# Altium project UI_Board.PrjPcb
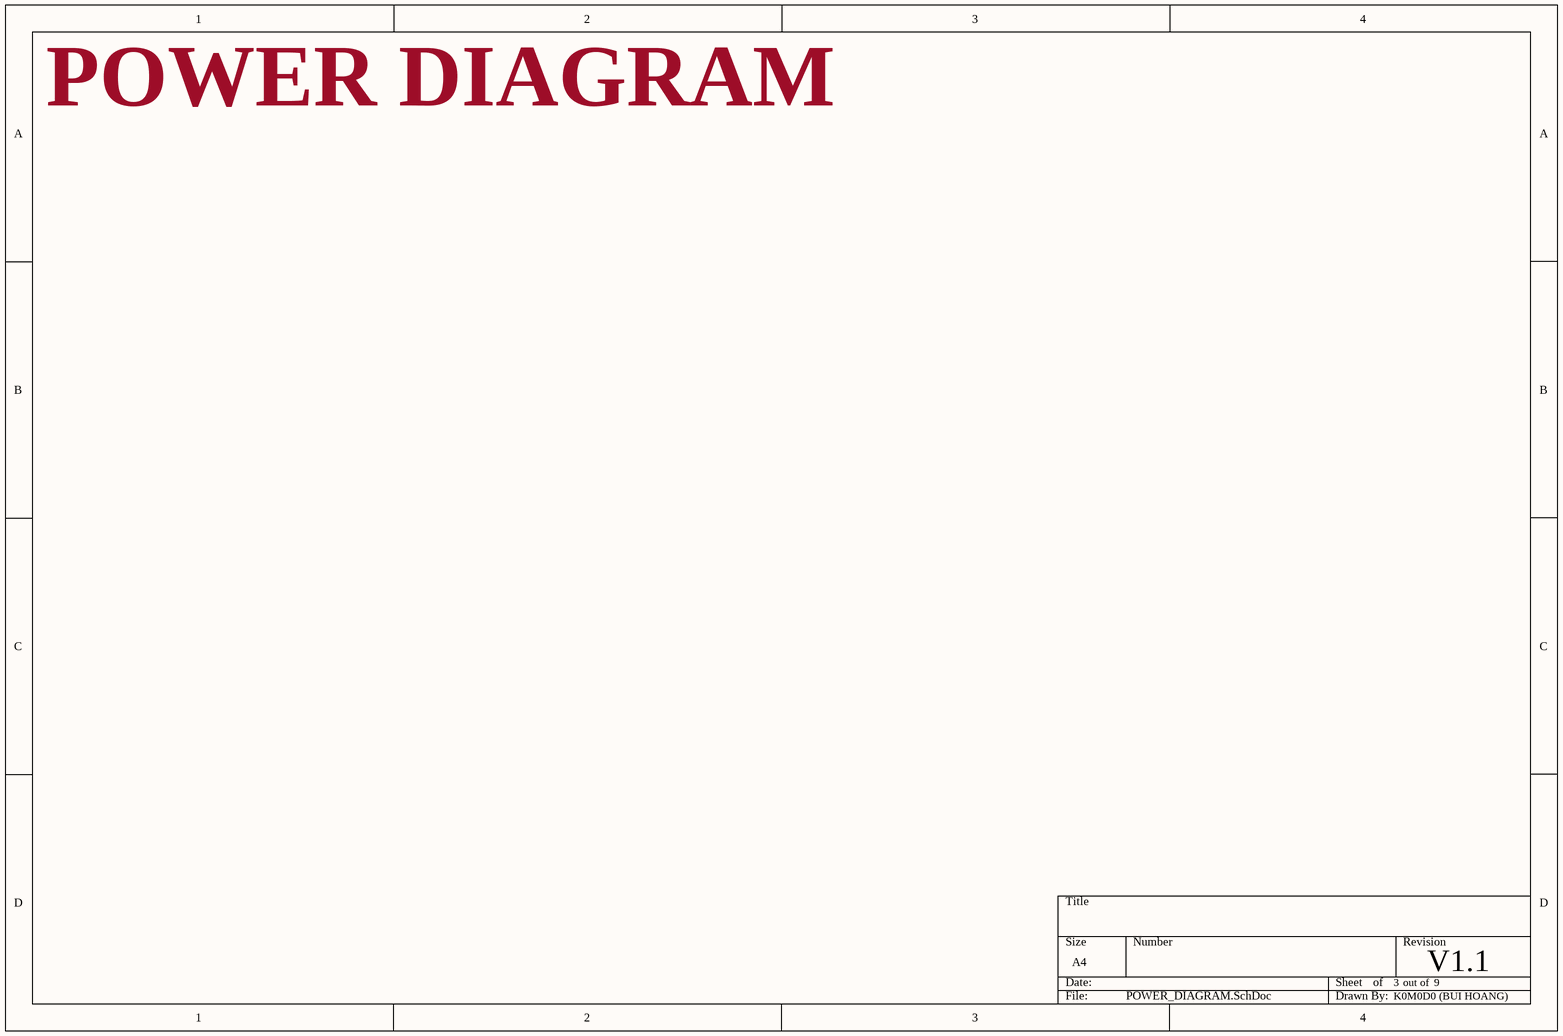
[diagram p0: POWER_DIAGRAM.SchDoc]
Author: K0M0D0 (BUI HOANG); Revision: V1.1; Title: UI BOARD
6 sheets, 197 parts. Net scope: flat (ports and power ports of the same name join across sheets).
Board file: UI_PCB.PcbDoc
Sheets:
  POWER_DIAGRAM.SchDoc
  LCD_PWR.SchDoc
  UI_MAIN.SchDoc
  F1C100s.SchDoc
  LCD.SchDoc
  CONNS.SchDoc

## Sheet POWER_DIAGRAM.SchDoc: UI BOARD
size A4; SheetNumber: 3; SheetTotal: 9

### Notes on the sheet
- POWER DIAGRAM
- out of

## Sheet LCD_PWR.SchDoc: UI BOARD
size A4; SheetNumber: 5; SheetTotal: 9
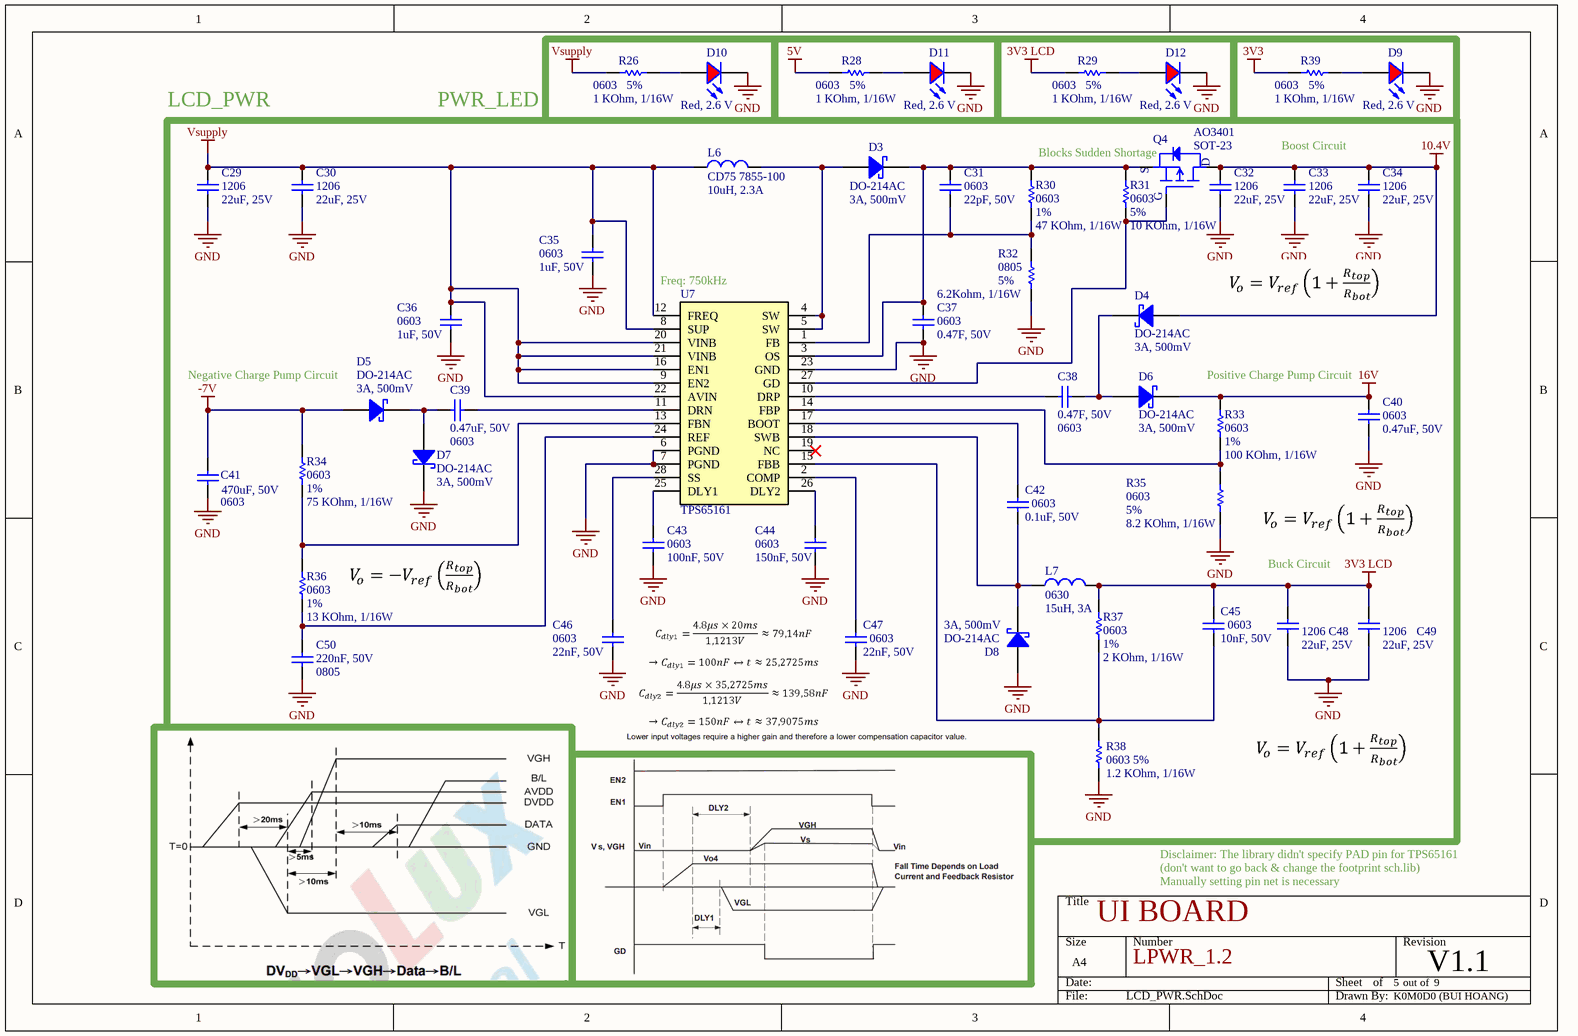
[diagram p1: LCD_PWR.SchDoc]

### Parts
C29  Package: 1206  [C_1206]  (hidden comment: 22uF, 25V)
C30  Package: 1206  [C_1206]  (hidden comment: 22uF, 25V)
C31  Package: 0603  [C_0603]  (hidden comment: 22pF, 50V)
C32  Package: 1206  [C_1206]  (hidden comment: 22uF, 25V)
C33  Package: 1206  [C_1206]  (hidden comment: 22uF, 25V)
C34  Package: 1206  [C_1206]  (hidden comment: 22uF, 25V)
C35  Package: 0603  [C_0603]  (hidden comment: 1uF, 50V)
C36  Package: 0603  [C_0603]  (hidden comment: 1uF, 50V)
C37  Package: 0603  [C_0603]  (hidden comment: 0.47F, 50V)
C38  Package: 0603  [C_0603]  (hidden comment: 0.47F, 50V)
C39  Package: 0603  [C_0603]  (hidden comment: 0.47uF, 50V)
C40  Package: 0603  [C_0603]  (hidden comment: 0.47uF, 50V)
C41  Package: 0603  [C_0603]  (hidden comment: 470uF, 50V)
C42  Package: 0603  [C_0603]  (hidden comment: 0.1uF, 50V)
C43  Package: 0603  [C_0603]  (hidden comment: 100nF, 50V)
C44  Package: 0603  [C_0603]  (hidden comment: 150nF, 50V)
C45  Package: 0603  [C_0603]  (hidden comment: 10nF, 50V)
C46  Package: 0603  [C_0603]  (hidden comment: 22nF, 50V)
C47  Package: 0603  [C_0603]  (hidden comment: 22nF, 50V)
C48  Package: 1206  [C_1206]  (hidden comment: 22uF, 25V)
C49  Package: 1206  [C_1206]  (hidden comment: 22uF, 25V)
C50  Package: 0805  [C_0805]  (hidden comment: 220nF, 50V)
D3  Package: DO-214AC  [PKG_SMA (DO-214AC)]  (hidden comment: 3A, 500mV)
D4  Package: DO-214AC  [PKG_SMA (DO-214AC)]  (hidden comment: 3A, 500mV)
D5  Package: DO-214AC  [PKG_SMA (DO-214AC)]  (hidden comment: 3A, 500mV)
D6  Package: DO-214AC  [PKG_SMA (DO-214AC)]  (hidden comment: 3A, 500mV)
D7  Package: DO-214AC  [PKG_SMA (DO-214AC)]  (hidden comment: 3A, 500mV)
D8  Package: DO-214AC  [PKG_SMA (DO-214AC)]  (hidden comment: 3A, 500mV)
D9  Red, 2.6 V  [LED_1206]
D10  Red, 2.6 V  [LED_1206]
D11  Red, 2.6 V  [LED_1206]
D12  Red, 2.6 V  [LED_1206]
L6  Package: CD75 7855-100  [COIL_CDRH]  (hidden comment: 10uH, 2.3A)
L7  Package: 0630  [COIL_74]  (hidden comment: 15uH, 3A)
Q4  AO3401  Package: SOT-23  [PKG_SOT-23]
R26  Package: 0603  Acc: 5%  [R_0603]  (hidden comment: 1 KOhm, 1/16W)
R28  Package: 0603  Acc: 5%  [R_0603]  (hidden comment: 1 KOhm, 1/16W)
R29  Package: 0603  Acc: 5%  [R_0603]  (hidden comment: 1 KOhm, 1/16W)
R30  Package: 0603  Acc: 1%  [R_0603]  (hidden comment: 47 KOhm, 1/16W)
R31  Package: 0603  Acc: 5%  [R_0603]  (hidden comment: 10 KOhm, 1/16W)
R32  Package: 0805  Acc: 5%  [R_0805]  (hidden comment: 6.2Kohm, 1/16W)
R33  Package: 0603  Acc: 1%  [R_0603]  (hidden comment: 100 KOhm, 1/16W)
R34  Package: 0603  Acc: 1%  [R_0603]  (hidden comment: 75 KOhm, 1/16W)
R35  Package: 0603  Acc: 5%  [R_0603]  (hidden comment: 8.2 KOhm, 1/16W)
R36  Package: 0603  Acc: 1%  [R_0603]  (hidden comment: 13 KOhm, 1/16W)
R37  Package: 0603  Acc: 1%  [R_0603]  (hidden comment: 2 KOhm, 1/16W)
R38  Package: 0603  Acc: 5%  [R_0603]  (hidden comment: 1.2 KOhm, 1/16W)
R39  Package: 0603  Acc: 5%  [R_0603]  (hidden comment: 1 KOhm, 1/16W)
U7  TPS65161  [PKG_HTSSOP-28]

### Nets
3V3: R39.1
3V3 LCD: C45.2 C48.2 C49.2 L7.2 R29.1 R37.2
5V: R28.1
10.4V: C32.2 C33.2 C34.2 D4.2(A) Q4.3(D)
16V: C40.2 D6.1(K) R33.2
-7V: C41.1 D5.2(A) R34.2
GND: C29.1 C30.1 C32.1 C33.1 C34.1 C35.1 C36.1 C37.1 C40.1 C41.2 C43.1 C44.1 C46.1 C47.1 C48.1 C49.1 C50.2 D7.1(K) D8.2(A) D9.1(K) D10.1(K) D11.1(K) D12.1(K) R32.1 R35.1 R38.1 U7.6(PGND) U7.7(PGND) U7.23(GND)
Vsupply: C29.2 C30.2 C35.2 C36.2 L6.1 R26.1 U7.8(SUP) U7.9(EN2) U7.12(FREQ) U7.16(EN1) U7.20(VINB) U7.21(VINB) U7.22(AVIN)
NetC31_1: C31.1 R30.1 R32.2 U7.1(FB)
NetC31_2: C31.2 C37.2 D3.1(K) Q4.2(S) R30.2 R31.2 U7.3(OS)
NetC38_1: C38.1 D4.1(K) D6.2(A)
NetC38_2: C38.2 U7.10(DRP)
NetC39_1: C39.1 U7.11(DRN)
NetC39_2: C39.2 D5.1(K) D7.2(A)
NetC42_1: C42.1 D8.1(K) L7.1 U7.18(SWB)
NetC42_2: C42.2 U7.17(BOOT)
NetC43_2: C43.2 U7.25(DLY1)
NetC44_2: C44.2 U7.26(DLY2)
NetC45_1: C45.1 R37.1 R38.2 U7.15(FBB)
NetC46_2: C46.2 U7.28(SS)
NetC47_2: C47.2 U7.2(COMP)
NetC50_1: C50.1 R36.1 U7.24(REF)
NetD3_2: D3.2(A) L6.2 U7.4(SW) U7.5(SW)
NetD9_2: D9.2(A) R39.2
NetD10_2: D10.2(A) R26.2
NetD11_2: D11.2(A) R28.2
NetD12_2: D12.2(A) R29.2
NetQ4_1: Q4.1(G) R31.1 U7.27(GD)
NetR33_1: R33.1 R35.2 U7.14(FBP)
NetR34_1: R34.1 R36.2 U7.13(FBN)

Not connected (* = marked no-connect by the designer): U7 19(NC)*

### Notes on the sheet
- LCD_PWR
- PWR_LED
- (near Q4) Blocks Sudden Shortage
- Boost Circuit
- (near U7) Freq: 750kHz
- (near D5) Negative Charge Pump Circuit
- Positive Charge Pump Circuit
- Buck Circuit
- Disclaimer: The library didn't specify PAD pin for TPS65161
- (don't want to go back & change the footprint sch.lib)
- Manually setting pin net is necessary
- LPWR_1.2
- out of

### Library data of the parts
C29 C30 C32-C34 C48 C49 = CAP_1206: Manufacturer 1: Vishay; Manufacturer Part Number 1: CAP0805; Supplier 1: Thegioiic; Datasheet: https://www.mouser.de/datasheet/2/447/PYu_RC_Group_51_RoHS_L_11-1984063.pdf; Supplier Link: N/a; Value: 22uF, 25V
C31 C35-C47 = CAP_0603: Manufacturer 1: Vishay; Manufacturer Part Number 1: CAP0603; Supplier 1: Thegioiic; Datasheet: https://www.mouser.de/datasheet/2/447/PYu_RC_Group_51_RoHS_L_11-1984063.pdf; Supplier Link: N/a
  C31: Value: 22pF, 50V
  C35 C36: Value: 1uF, 50V
  C37 C38: Value: 0.47F, 50V
  C39 C40: Value: 0.47uF, 50V
  C41: Value: 470uF, 50V
  C42: Value: 0.1uF, 50V
  C43: Value: 100nF, 50V
  C44: Value: 150nF, 50V
  C45: Value: 10nF, 50V
  C46 C47: Value: 22nF, 50V
C50 = CAP_0805: Manufacturer 1: Vishay; Manufacturer Part Number 1: CAP0805; Supplier 1: Thegioiic; Datasheet: https://www.mouser.de/datasheet/2/447/PYu_RC_Group_51_RoHS_L_11-1984063.pdf; Supplier Link: N/a; Value: 220nF, 50V
D3-D8 = SCHOTTKY: SS34; Manufacturer 1: OEM; Manufacturer Part Number 1: N/a; ComponentLink1Description: Datasheet; ComponentLink1URL: https://www.vishay.com/doc?89055; Supplier 1: Thegioiic; Datasheet: N/a; Supplier Link: N/a; Value: 3A, 500mV
D9-D12 = RED: Red LED; Manufacturer 1: LITE-ON; Manufacturer Part Number 1: LEDR; ComponentLink1Description: Datasheet link; ComponentLink1URL: N/A; ComponentLink2Description: Supplier 1 URL; ComponentLink2URL: https://www.mouser.vn/ProductDetail/ROHM-Semiconductor/SML-H12U8TT86C?qs=HXFqYaX1Q2xs%2F%252BL6XLQEvw%3D%3D; ComponentLink3Description: Supplier 2 URL; ComponentLink3URL: https://www.digikey.com/en/products/detail/liteon/LTST-C171KRKT/386801; ComponentLink4Description: Supplier 3 URL; ComponentLink4URL: https://www.thegioiic.com/led-do-0805-dan-smd-trong-suot-harvatek; Supplier 1: ICDAYROI; Datasheet: https://www.mouser.com/datasheet/2/239/LTST-S326KGKFKT-1143909.pdf?srsltid=AfmBOorgg6Gh4PD3T9FRO6Da906Aqdqx3RSjbUQRSIXh-3hATfgAoF8Q; Supplier Link: https://icdayroi.com/led-smd-0805; Package: 1206; Value: Red, 2.6 V
L6 = IN_CD104_100: Manufacturer 1: OEM; Manufacturer Part Number 1: N/a; ComponentLink2Description: Supplier 1 URL; ComponentLink2URL: https://www.mouser.vn/ProductDetail/TDK/MLZ1608DR10DTD25?qs=u4%252BEJ9urDARQOELDKhLR2A%3D%3D; ComponentLink1Description: Datasheet; ComponentLink1URL: https://product.tdk.com/system/files/dam/doc/product/inductor/inductor/smd/catalog/inductor_automotive_decoupling_mlz1608_en.pdf?ref_disty=mouser; ComponentLink3Description: Supplier 2 URL; ComponentLink3URL: https://www.digikey.com/en/products/detail/tdk-corporation/MLZ1608DR10DTD25/4743170; ComponentLink4Description: Supplier 3 URL; Supplier 1: Thegioiic; Datasheet: N/a; Supplier Link: N/a; Value: 10uH, 2.3A
L7 = IN_0630: Manufacturer 1: OEM; Manufacturer Part Number 1: N/a; ComponentLink2Description: Supplier 1 URL; ComponentLink2URL: https://www.mouser.vn/ProductDetail/TDK/MLZ1608M100WTD25?qs=u4%252BEJ9urDATpNhOvJ54DAQ%3D%3D; ComponentLink1Description: Datasheet; ComponentLink1URL: https://product.tdk.com/system/files/dam/doc/product/inductor/inductor/smd/catalog/inductor_automotive_decoupling_mlz1608_en.pdf?ref_disty=mouser; ComponentLink3Description: Supplier 2 URL; ComponentLink3URL: https://www.digikey.com/en/products/detail/tdk-corporation/MLZ1608M100WTD25/4743176; ComponentLink4Description: Supplier 3 URL; Supplier 1: Thegioiic; Datasheet: N/a; Supplier Link: N/a; Value: 15uH, 3A
Q4 = AO3401: P-Channel 30 V 4A (Ta) 1.4W (Ta) Surface Mount SOT-23-3; Manufacturer 1: Alpha&Omega Semi.; Manufacturer Part Number 1: AO3401; Supplier 1: ICDayroi; Datasheet: https://www.snapeda.com/parts/AO3401/Alpha%20&%20Omega%20Semiconductor/datasheet/; Supplier Link: https://icdayroi.com/ao3401
R26 R28-R31 R33-R39 = RES_0603: Manufacturer 1: Vishay; Manufacturer Part Number 1: RES0603; Supplier 1: Thegioiic; Datasheet: https://www.mouser.de/datasheet/2/447/PYu_RC_Group_51_RoHS_L_11-1984063.pdf; Supplier Link: N/a
  R26 R28 R29 R39: Value: 1 KOhm, 1/16W
  R30: Value: 47 KOhm, 1/16W
  R31: Value: 10 KOhm, 1/16W
  R33: Value: 100 KOhm, 1/16W
  R34: Value: 75 KOhm, 1/16W
  R35: Value: 8.2 KOhm, 1/16W
  R36: Value: 13 KOhm, 1/16W
  R37: Value: 2 KOhm, 1/16W
  R38: Value: 1.2 KOhm, 1/16W
R32 = RES_0805: Manufacturer 1: Vishay; Manufacturer Part Number 1: RES0805; Supplier 1: Thegioiic; Datasheet: https://www.mouser.de/datasheet/2/447/PYu_RC_Group_51_RoHS_L_11-1984063.pdf; Supplier Link: N/a; Value: 6.2Kohm, 1/16W
U7 = TPS65161: BIAS POWER SUPPLY FOR TV AND MONITOR TFT LCD PANELS; Manufacturer 1: TI; Manufacturer Part Number 1: TPS65161; Supplier 1: shoppee; Datasheet: https://www.ti.com/lit/ds/symlink/tps65161.pdf?ts=1780769383696&ref_url=https%253A%252F%252Fwww.google.com%252F; Supplier Link: https://shopee.vn/5-C%C3%81I-TPS65161PWPR-TSSOP28-TPS65161-TSSOP-28-TPS65161PW-TSSOP-TPS65161PWP-linh-ki%E1%BB%87n-%C4%91i%E1%BB%87n-t%E1%BB%AD-vanxy-i.1274879032.50207449630

## Sheet UI_MAIN.SchDoc: UI BOARD
size A4; SheetNumber: 6; SheetTotal: 9
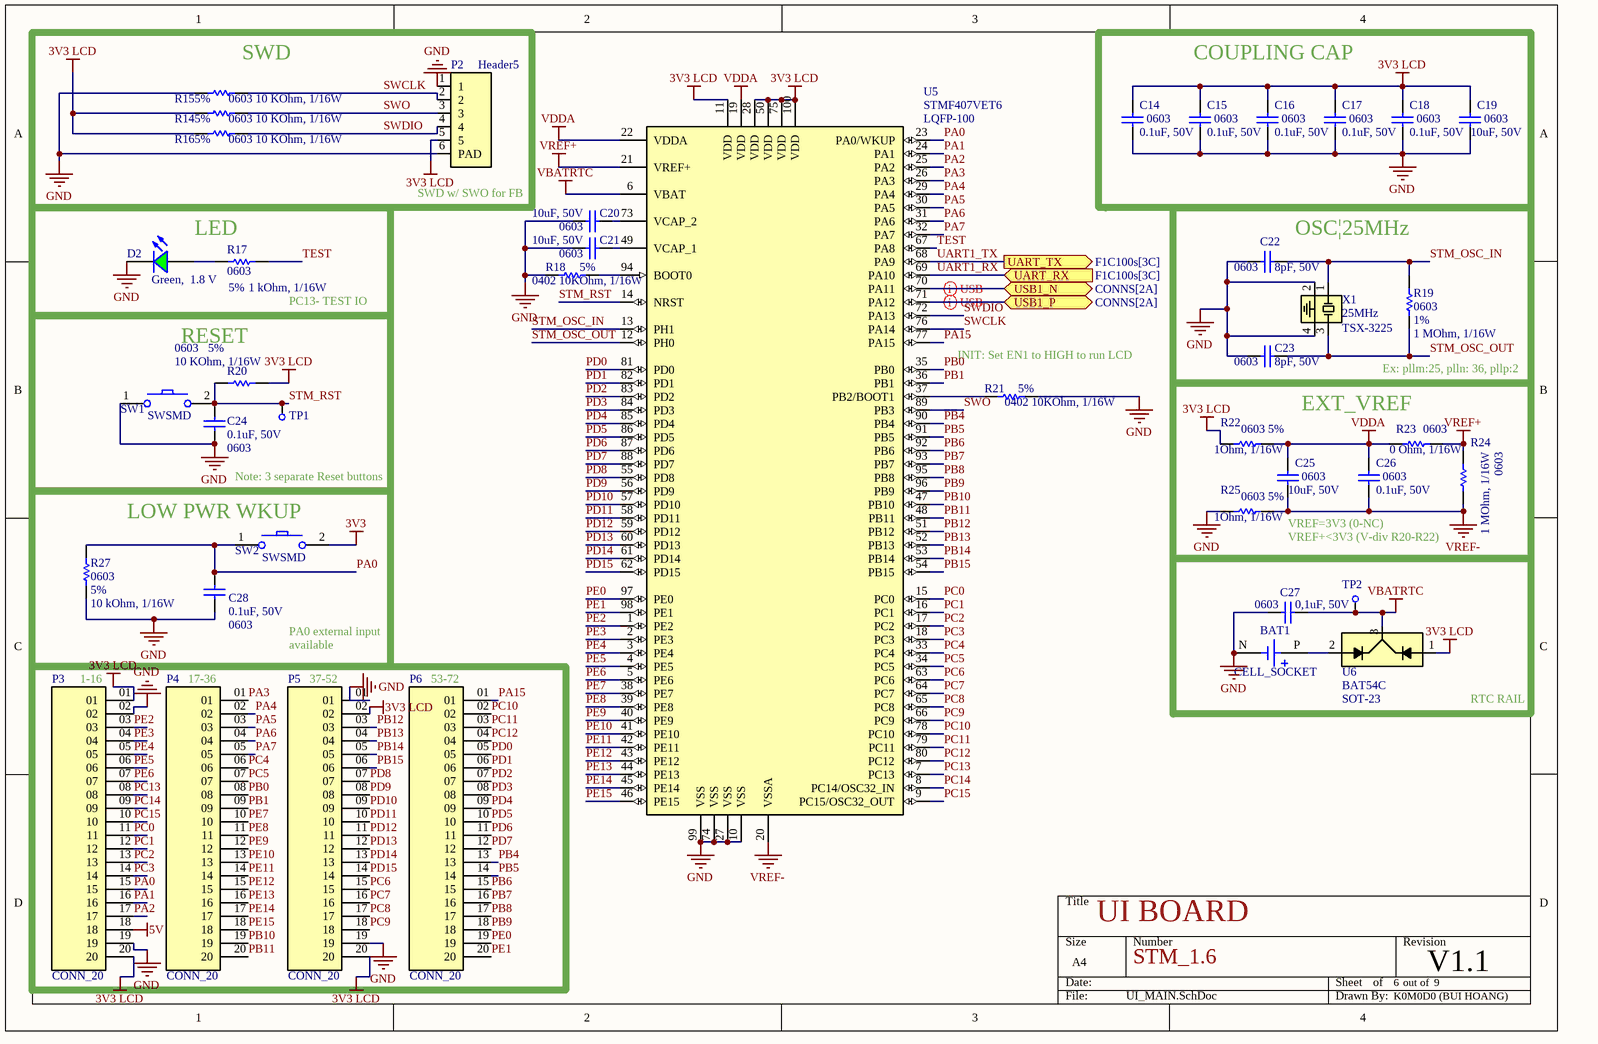
[diagram p2: UI_MAIN.SchDoc]

### Parts
BAT1  CELL_SOCKET  [CELL_SOCKET]
C14  Package: 0603  [C_0603]  (hidden comment: 0.1uF, 50V)
C15  Package: 0603  [C_0603]  (hidden comment: 0.1uF, 50V)
C16  Package: 0603  [C_0603]  (hidden comment: 0.1uF, 50V)
C17  Package: 0603  [C_0603]  (hidden comment: 0.1uF, 50V)
C18  Package: 0603  [C_0603]  (hidden comment: 0.1uF, 50V)
C19  Package: 0603  [C_0603]  (hidden comment: 10uF, 50V)
C20  Package: 0603  [C_0603]  (hidden comment: 10uF, 50V)
C21  Package: 0603  [C_0603]  (hidden comment: 10uF, 50V)
C22  Package: 0603  [C_0603]  (hidden comment: 8pF, 50V)
C23  Package: 0603  [C_0603]  (hidden comment: 8pF, 50V)
C24  Package: 0603  [C_0603]  (hidden comment: 0.1uF, 50V)
C25  Package: 0603  [C_0603]  (hidden comment: 10uF, 50V)
C26  Package: 0603  [C_0603]  (hidden comment: 0.1uF, 50V)
C27  Package: 0603  [C_0603]  (hidden comment: 0,1uF, 50V)
C28  Package: 0603  [C_0603]  (hidden comment: 0.1uF, 50V)
D2  Green,  1.8 V  [LED_0603]
P2  Header5  [CONN_Header5]
P3  CONN_20  [CONN_20]
P4  CONN_20  [CONN_20]
P5  CONN_20  [CONN_20]
P6  CONN_20  [CONN_20]
R14  Package: 0603  Acc: 5%  [R_0603]  (hidden comment: 10 KOhm, 1/16W)
R15  Package: 0603  Acc: 5%  [R_0603]  (hidden comment: 10 KOhm, 1/16W)
R16  Package: 0603  Acc: 5%  [R_0603]  (hidden comment: 10 KOhm, 1/16W)
R17  Package: 0603  Acc: 5%  [R_0603]  (hidden comment: 1 kOhm, 1/16W)
R18  Package: 0402  Acc: 5%  [R_0402]  (hidden comment: 10KOhm, 1/16W)
R19  Package: 0603  Acc: 1%  [R_0603]  (hidden comment: 1 MOhm, 1/16W)
R20  Package: 0603  Acc: 5%  [R_0603]  (hidden comment: 10 KOhm, 1/16W)
R21  Package: 0402  Acc: 5%  [R_0402]  (hidden comment: 10KOhm, 1/16W)
R22  Package: 0603  Acc: 5%  [R_0603]  (hidden comment: 1Ohm, 1/16W)
R23  Package: 0603  [R_0603]  (hidden comment: 0 Ohm, 1/16W)
R24  Package: 0603  [R_0603]  (hidden comment: 1 MOhm, 1/16W)
R25  Package: 0603  Acc: 5%  [R_0603]  (hidden comment: 1Ohm, 1/16W)
R27  Package: 0603  Acc: 5%  [R_0603]  (hidden comment: 10 kOhm, 1/16W)
SW1  SWSMD  [SW_SMD_NOGND]
SW2  SWSMD  [SW_SMD_NOGND]
TP1  TESTPT  [TESTPT]  (value not drawn)  (no BOM)
TP2  TESTPT  [TESTPT]  (value not drawn)  (no BOM)
U5  STMF407VET6  Package: LQFP-100  [PKG_LQFP-100]
U6  BAT54C  Package: SOT-23  [PKG_SOT-23]
X1  25MHz  Package: TSX-3225  [PKG_TSX-3225]

### Blocks framed on the sheet
SWD: P2 R14-R16
COUPLING CAP: C14-C19
LED: D2 R17
OSC|25MHz: C22 C23 R19 X1
RESET: C24 R20 SW1 TP1
EXT_VREF: C25 C26 R22-R25
LOW PWR WKUP: C28 R27 SW2

### Ports
UART_RX (in, see F1C100s[3C]), UART_TX (out, see F1C100s[3C]), USB1_N (bidir, see CONNS[2A]), USB1_P (bidir, see CONNS[2A])

### Nets
3V3: SW2.2
3V3 LCD: C14.2 C15.2 C16.2 C17.2 C18.2 C19.2 P2.5 P3.01 P3.20 P5.02 P5.20 R14.1 R16.1 R20.2 R22.1 U5.11(VDD) U5.28(VDD) U5.50(VDD) U5.75(VDD) U5.100(VDD) U6.1
5V: P3.18
GND: BAT1.N C14.1 C15.1 C16.1 C17.1 C18.1 C19.1 C20.2 C21.2 C22.1 C23.1 C24.1 C27.1 C28.1 D2.1(K) P2.1 P2.6(PAD) P3.02 P3.19 P5.01 P5.19 R15.1 R18.1 R21.2 R25.1 R27.1 SW1.1 U5.10(VSS) U5.27(VSS) U5.74(VSS) U5.99(VSS) X1.2 X1.4
VBATRTC: C27.2 TP2.1 U5.6(VBAT) U6.3
VDDA: C25.2 C26.2 R22.2 R23.1 U5.19(VDD) U5.22(VDDA)
VREF+: R23.2 R24.2 U5.21(VREF+)
VREF-: C25.1 C26.1 R24.1 R25.2 U5.20(VSSA)
PA0: C28.2 P3.15 R27.2 SW2.1 U5.23(PA0/WKUP)
PA1: P3.16 U5.24(PA1)
PA2: P3.17 U5.25(PA2)
PA3: P4.01 U5.26(PA3)
PA4: P4.02 U5.29(PA4)
PA5: P4.03 U5.30(PA5)
PA6: P4.04 U5.31(PA6)
PA7: P4.05 U5.32(PA7)
PA15: P6.01 U5.77(PA15)
PB0: P4.08 U5.35(PB0)
PB1: P4.09 U5.36(PB1)
PB4: P6.13 U5.90(PB4)
PB5: P6.14 U5.91(PB5)
PB6: P6.15 U5.92(PB6)
PB7: P6.16 U5.93(PB7)
PB8: P6.17 U5.95(PB8)
PB9: P6.18 U5.96(PB9)
PB10: P4.19 U5.47(PB10)
PB11: P4.20 U5.48(PB11)
PB12: P5.03 U5.51(PB12)
PB13: P5.04 U5.52(PB13)
PB14: P5.05 U5.53(PB14)
PB15: P5.06 U5.54(PB15)
PC0: P3.11 U5.15(PC0)
PC1: P3.12 U5.16(PC1)
PC2: P3.13 U5.17(PC2)
PC3: P3.14 U5.18(PC3)
PC4: P4.06 U5.33(PC4)
PC5: P4.07 U5.34(PC5)
PC6: P5.15 U5.63(PC6)
PC7: P5.16 U5.64(PC7)
PC8: P5.17 U5.65(PC8)
PC9: P5.18 U5.66(PC9)
PC10: P6.02 U5.78(PC10)
PC11: P6.03 U5.79(PC11)
PC12: P6.04 U5.80(PC12)
PC13: P3.08 U5.7(PC13)
PC14: P3.09 U5.8(PC14/OSC32_IN)
PC15: P3.10 U5.9(PC15/OSC32_OUT)
PD0: P6.05 U5.81(PD0)
PD1: P6.06 U5.82(PD1)
PD2: P6.07 U5.83(PD2)
PD3: P6.08 U5.84(PD3)
PD4: P6.09 U5.85(PD4)
PD5: P6.10 U5.86(PD5)
PD6: P6.11 U5.87(PD6)
PD7: P6.12 U5.88(PD7)
PD8: P5.07 U5.55(PD8)
PD9: P5.08 U5.56(PD9)
PD10: P5.09 U5.57(PD10)
PD11: P5.10 U5.58(PD11)
PD12: P5.11 U5.59(PD12)
PD13: P5.12 U5.60(PD13)
PD14: P5.13 U5.61(PD14)
PD15: P5.14 U5.62(PD15)
PE0: P6.19 U5.97(PE0)
PE1: P6.20 U5.98(PE1)
PE2: P3.03 U5.1(PE2)
PE3: P3.04 U5.2(PE3)
PE4: P3.05 U5.3(PE4)
PE5: P3.06 U5.4(PE5)
PE6: P3.07 U5.5(PE6)
PE7: P4.10 U5.38(PE7)
PE8: P4.11 U5.39(PE8)
PE9: P4.12 U5.40(PE9)
PE10: P4.13 U5.41(PE10)
PE11: P4.14 U5.42(PE11)
PE12: P4.15 U5.43(PE12)
PE13: P4.16 U5.44(PE13)
PE14: P4.17 U5.45(PE14)
PE15: P4.18 U5.46(PE15)
STM_OSC_IN: C22.2 R19.2 U5.13(PH1) X1.1
STM_OSC_OUT: C23.2 R19.1 U5.12(PH0) X1.3
STM_RST: C24.2 R20.1 SW1.2 TP1.1 U5.14(NRST)
SWCLK: P2.2 R15.2 U5.76(PA14)
SWDIO: P2.4 R16.2 U5.72(PA13)
SWO: P2.3 R14.2 U5.89(PB3)
TEST: R17.2 U5.67(PA8)
UART1_RX: U5.69(PA10) ; port UART_RX  [project net RX]
UART1_TX: U5.68(PA9) ; port UART_TX  [project net TX]
USB1_N: U5.70(PA11) ; port USB1_N
USB1_P: U5.71(PA12) ; port USB1_P
NetBAT1_P: BAT1.P U6.2
NetC20_1: C20.1 U5.73(VCAP_2)
NetC21_1: C21.1 U5.49(VCAP_1)
NetD2_2: D2.2(A) R17.1
NetR18_2: R18.2 U5.94(BOOT0)
NetR21_1: R21.1 U5.37(PB2/BOOT1)

### Layout directives
differential pair: USB1_N, USB1_P

### Notes on the sheet
- (near P2) SWD w/ SWO for FB
- (near R17) PC13- TEST IO
- INIT: Set EN1 to HIGH to run LCD
- Ex: pllm:25, plln: 36, pllp:2
- Note: 3 separate Reset buttons
- VREF=3V3 (0-NC)
- VREF+<3V3 (V-div R20-R22)
- (near P5) available
- PA0 external input
- (near P3) 1-16
- (near P4) 17-36
- (near P5) 37-52
- (near P6) 53-72
- RTC RAIL
- STM_1.6
- out of

### Library data of the parts
BAT1 = CELL_SOCKET: Battery Holder (CELL_PIN); Manufacturer 1: N/a; Manufacturer Part Number 1: N/a; Supplier 1: thegioiic; Datasheet: N/a; Supplier Link: https://www.thegioiic.com/de-pin-cr2032-3v-xuyen-lo
C14-C28 = CAP_0603: as C31 on sheet LCD_PWR; Supplier 1: Thegioiic; Datasheet: https://www.mouser.de/datasheet/2/447/PYu_RC_Group_51_RoHS_L_11-1984063.pdf; Supplier Link: N/a
  C14-C18 C24 C26 C28: Value: 0.1uF, 50V
  C19-C21 C25: Value: 10uF, 50V
  C22 C23: Value: 8pF, 50V
  C27: Value: 0,1uF, 50V
D2 = GREEN: Green LED; Manufacturer 1: LITE-ON; Manufacturer Part Number 1: LEDG; ComponentLink1Description: Datasheet link; ComponentLink1URL: N/A; ComponentLink2Description: Supplier 1 URL; ComponentLink2URL: https://www.mouser.vn/ProductDetail/Broadcom-Avago/HSMG-C170?qs=YDL0qNrpDT4lm8ArMPkMEA%3D%3D; ComponentLink3Description: Supplier 2 URL; ComponentLink3URL: SML-LXT0805GW-TR Lumex Opto/Components Inc. | Optoelectronics | DigiKey; ComponentLink4Description: Supplier 3 URL; ComponentLink4URL: N/A; Supplier 1: ICDAYROI; Datasheet: https://www.mouser.com/datasheet/2/239/LTST-S326KGKFKT-1143909.pdf?srsltid=AfmBOorgg6Gh4PD3T9FRO6Da906Aqdqx3RSjbUQRSIXh-3hATfgAoF8Q; Supplier Link: https://icdayroi.com/led-smd-0805; Package: 1206; Value: Green,  1.8 V
P2 = HEADER5: Header 5 pins (2.54mm); Manufacturer 1: OEM; Manufacturer Part Number 1: XH2.54mm 5; Supplier 1: Thegioiic; Datasheet: N/a; Supplier Link: https://www.thegioiic.com/dau-xh2-54mm-5-chan-dan-smd-nam-ngang
P3-P6 = CONN_20: Header 20 pins (2.54mm); Manufacturer 1: OEM; Manufacturer Part Number 1: N/a; Supplier 1: N/a; Datasheet: N/a; Supplier Link: N/a
R14-R17 R19 R20 R22-R25 R27 = RES_0603: as R26 on sheet LCD_PWR; Supplier 1: Thegioiic; Datasheet: https://www.mouser.de/datasheet/2/447/PYu_RC_Group_51_RoHS_L_11-1984063.pdf; Supplier Link: N/a
  R14-R16 R20: Value: 10 KOhm, 1/16W
  R17: Value: 1 kOhm, 1/16W
  R19 R24: Value: 1 MOhm, 1/16W
  R22 R25: Value: 1Ohm, 1/16W
  R23: Value: 0 Ohm, 1/16W
  R27: Value: 10 kOhm, 1/16W
R18 R21 = RES_0402: Manufacturer 1: Vishay; Manufacturer Part Number 1: RES0402; Supplier 1: Thegioiic; Datasheet: https://www.mouser.de/datasheet/2/447/PYu_RC_Group_51_RoHS_L_11-1984063.pdf; Supplier Link: N/a; Value: 10KOhm, 1/16W
SW1 SW2 = SWSMD_NOGND: SW_SMD; Manufacturer 1: OEM; Manufacturer Part Number 1: N/a; Supplier 1: Thegioiic; Datasheet: N/a; Supplier Link: https://www.thegioiic.com/nut-nhan-3x6mm-cao-3-5mm-4-chan-smd-chinh-ngang
TP1 TP2 = TESTPT: Test point
U5 = STMF407VET6: Arm® Cortex®-M4 32b MCU+FPU, 210DMIPS, up to 1MB flash/192+4KB RAM, USB / OTG HS/FS, Ethernet, 17 TIMs, 3 ADCs, 15 comm. interfaces, and camera; Manufacturer 1: STMicroelectronics; Manufacturer Part Number 1: STMF407VET6; Supplier 1: Thegioiic; Datasheet: https://www.st.com/content/ccc/resource/technical/document/datasheet/ef/92/76/6d/bb/c2/4f/f7/DM00037051.pdf/files/DM00037051.pdf/jcr:content/translations/en.DM00037051.pdf; Supplier Link: https://www.thegioiic.com/stm32f407vet6-32-bit-arm-cortex-m4-microcontroller-168mhz-512kb-flash-100-lqfp
U6 = BAT54C: P-Channel 30 V 4A (Ta) 1.4W (Ta) Surface Mount SOT-23-3; Manufacturer 1: ON Semiconductor; Manufacturer Part Number 1: BAT54C; Supplier 1: thegioiic; Datasheet: https://media.digikey.com/pdf/Data%20Sheets/ON%20Semiconductor%20PDFs/BAT54(A,C,S).pdf; Supplier Link: https://www.thegioiic.com/bat54c
X1 = XTAL: Crystal, 25 MHz, -30 to 85 degC, 3.2 x 2.5 x 0.9 mm SMD; Manufacturer 1: EPSON; Manufacturer Part Number 1: TSX-3225 25.0000MF20P-C0; Supplier 1: Thegioiic; Datasheet: https://www.epsondevice.com/crystal/en/; Supplier Link: https://www.thegioiic.com/thach-anh-25mhz-3225-4-chan-smd

## Sheet F1C100s.SchDoc: UI BOARD
size A4; SheetNumber: 7; SheetTotal: 9
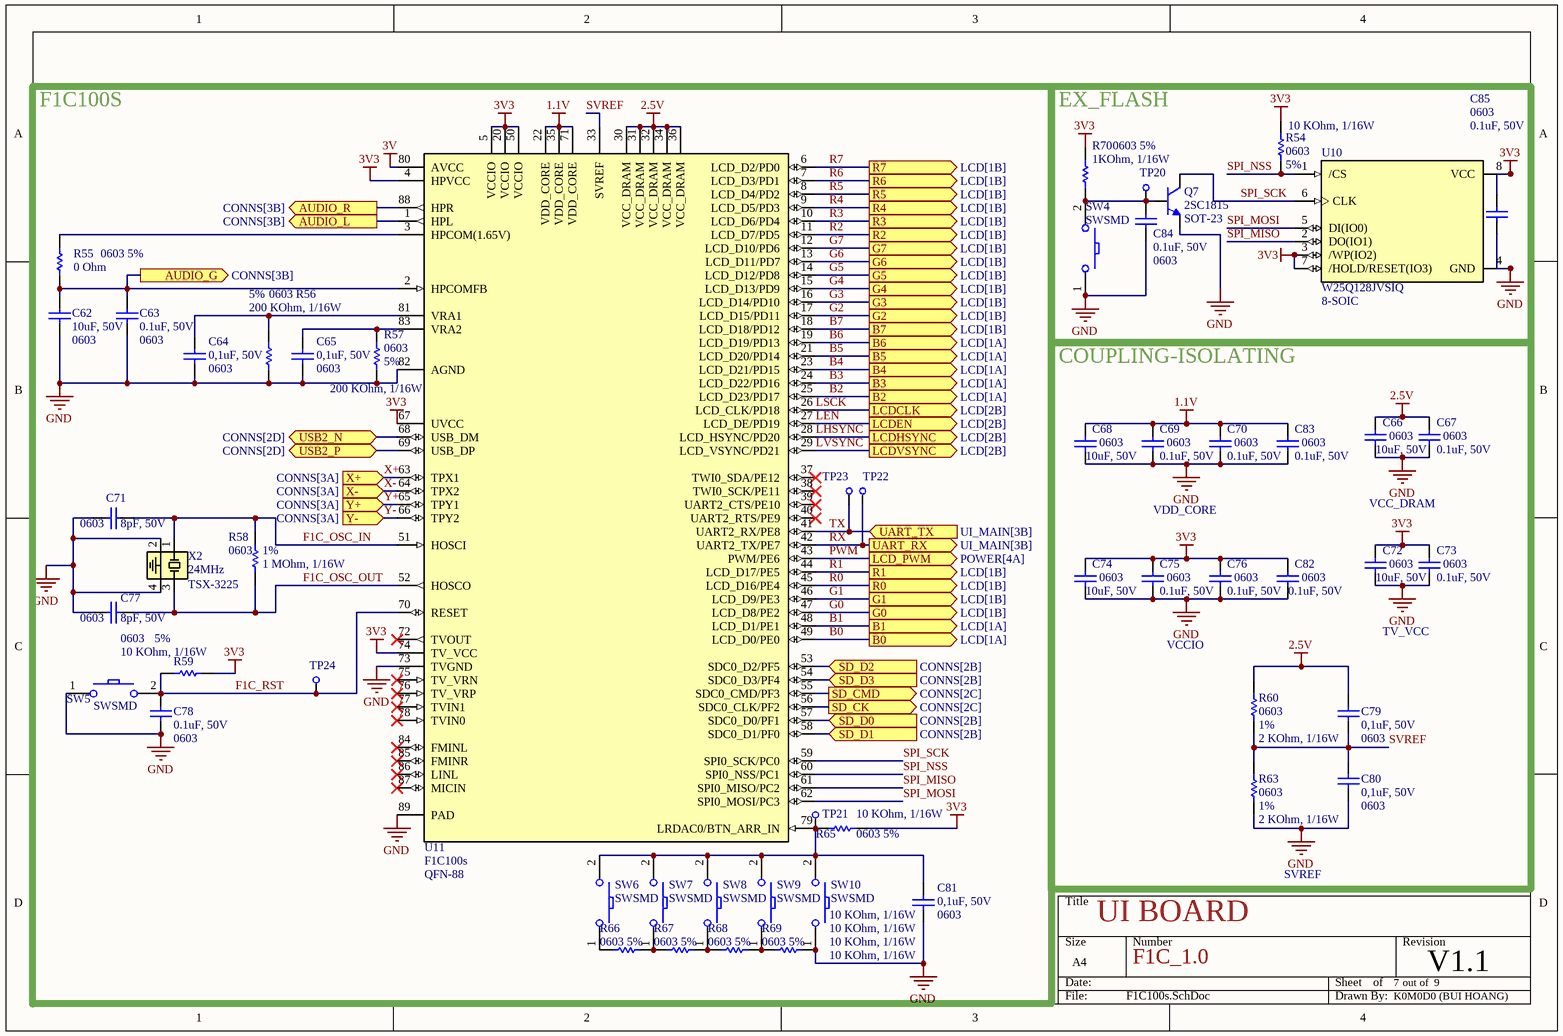
[diagram p3: F1C100s.SchDoc]

### Parts
C62  Package: 0603  [C_0603]  (hidden comment: 10uF, 50V)
C63  Package: 0603  [C_0603]  (hidden comment: 0.1uF, 50V)
C64  Package: 0603  [C_0603]  (hidden comment: 0,1uF, 50V)
C65  Package: 0603  [C_0603]  (hidden comment: 0,1uF, 50V)
C66  Package: 0603  [C_0603]  (hidden comment: 10uF, 50V)
C67  Package: 0603  [C_0603]  (hidden comment: 0.1uF, 50V)
C68  Package: 0603  [C_0603]  (hidden comment: 10uF, 50V)
C69  Package: 0603  [C_0603]  (hidden comment: 0.1uF, 50V)
C70  Package: 0603  [C_0603]  (hidden comment: 0.1uF, 50V)
C71  Package: 0603  [C_0603]  (hidden comment: 8pF, 50V)
C72  Package: 0603  [C_0603]  (hidden comment: 10uF, 50V)
C73  Package: 0603  [C_0603]  (hidden comment: 0.1uF, 50V)
C74  Package: 0603  [C_0603]  (hidden comment: 10uF, 50V)
C75  Package: 0603  [C_0603]  (hidden comment: 0.1uF, 50V)
C76  Package: 0603  [C_0603]  (hidden comment: 0.1uF, 50V)
C77  Package: 0603  [C_0603]  (hidden comment: 8pF, 50V)
C78  Package: 0603  [C_0603]  (hidden comment: 0.1uF, 50V)
C79  Package: 0603  [C_0603]  (hidden comment: 0,1uF, 50V)
C80  Package: 0603  [C_0603]  (hidden comment: 0,1uF, 50V)
C81  Package: 0603  [C_0603]  (hidden comment: 0,1uF, 50V)
C82  Package: 0603  [C_0603]  (hidden comment: 0.1uF, 50V)
C83  Package: 0603  [C_0603]  (hidden comment: 0.1uF, 50V)
C84  Package: 0603  [C_0603]  (hidden comment: 0.1uF, 50V)
C85  Package: 0603  [C_0603]  (hidden comment: 0.1uF, 50V)
Q7  2SC1815  Package: SOT-23  [PKG_SOT-23]
R54  Package: 0603  Acc: 5%  [R_0603]  (hidden comment: 10 KOhm, 1/16W)
R55  Package: 0603  Acc: 5%  [R_0603]  (hidden comment: 0 Ohm)
R56  Package: 0603  Acc: 5%  [R_0603]  (hidden comment: 200 KOhm, 1/16W)
R57  Package: 0603  Acc: 5%  [R_0603]  (hidden comment: 200 KOhm, 1/16W)
R58  Package: 0603  Acc: 1%  [R_0603]  (hidden comment: 1 MOhm, 1/16W)
R59  Package: 0603  Acc: 5%  [R_0603]  (hidden comment: 10 KOhm, 1/16W)
R60  Package: 0603  Acc: 1%  [R_0603]  (hidden comment: 2 KOhm, 1/16W)
R63  Package: 0603  Acc: 1%  [R_0603]  (hidden comment: 2 KOhm, 1/16W)
R65  Package: 0603  Acc: 5%  [R_0603]  (hidden comment: 10 KOhm, 1/16W)
R66  Package: 0603  Acc: 5%  [R_0603]  (hidden comment: 10 KOhm, 1/16W)
R67  Package: 0603  Acc: 5%  [R_0603]  (hidden comment: 10 KOhm, 1/16W)
R68  Package: 0603  Acc: 5%  [R_0603]  (hidden comment: 10 KOhm, 1/16W)
R69  Package: 0603  Acc: 5%  [R_0603]  (hidden comment: 10 KOhm, 1/16W)
R70  Package: 0603  Acc: 5%  [R_0603]  (hidden comment: 1KOhm, 1/16W)
SW4  SWSMD  [SW_SMD_NOGND]
SW5  SWSMD  [SW_SMD_NOGND]
SW6  SWSMD  [SW_SMD_NOGND]
SW7  SWSMD  [SW_SMD_NOGND]
SW8  SWSMD  [SW_SMD_NOGND]
SW9  SWSMD  [SW_SMD_NOGND]
SW10  SWSMD  [SW_SMD_NOGND]
TP20  TESTPT  [TESTPT]  (value not drawn)  (no BOM)
TP21  TESTPT  [TESTPT]  (value not drawn)  (no BOM)
TP22  TESTPT  [TESTPT]  (value not drawn)  (no BOM)
TP23  TESTPT  [TESTPT]  (value not drawn)  (no BOM)
TP24  TESTPT  [TESTPT]  (value not drawn)  (no BOM)
U10  W25Q128JVSIQ  Package: 8-SOIC  [PKG_8-SOIC]
U11  F1C100s  Package: QFN-88  [PKG_QFN-88]
X2  24MHz  Package: TSX-3225  [PKG_TSX-3225]

### Blocks framed on the sheet
F1C100S: C62-C65 C71 C77 C78 C81 R55-R59 R65-R69 SW5-SW10 TP21-TP24 U11 X2
EX_FLASH: C84 C85 Q7 R54 R70 SW4 TP20 U10
COUPLING-ISOLATING: C66-C70 C72-C76 C79 C80 C82 C83 R60 R63

### Ports
AUDIO_G (out, see CONNS[3B]), AUDIO_L (out, see CONNS[3B]), AUDIO_R (out, see CONNS[3B]), B0 (out, see LCD[1A]), B1 (out, see LCD[1A]), B2 (out, see LCD[1A]), B3 (out, see LCD[1A]), B4 (out, see LCD[1A]), B5 (out, see LCD[1A]), B6 (out, see LCD[1A]), B7 (out, see LCD[1B]), G0 (out, see LCD[1B]), G1 (out, see LCD[1B]), G2 (out, see LCD[1B]), G3 (out, see LCD[1B]), G4 (out, see LCD[1B]), G5 (out, see LCD[1B]), G6 (out, see LCD[1B]), G7 (out, see LCD[1B]), LCD_PWM (out, see POWER[4A]), LCDCLK (out, see LCD[2B]), LCDEN (out, see LCD[2B]), LCDHSYNC (out, see LCD[2B]), LCDVSYNC (out, see LCD[2B]), R0 (out, see LCD[1B]), R1 (out, see LCD[1B]), R2 (out, see LCD[1B]), R3 (out, see LCD[1B]), R4 (out, see LCD[1B]), R5 (out, see LCD[1B]), R6 (out, see LCD[1B]), R7 (out, see LCD[1B]), SD_CK (out, see CONNS[2C]), SD_CMD (out, see CONNS[2C]), SD_D0 (in, see CONNS[2B]), SD_D1 (in, see CONNS[2B]), SD_D2 (in, see CONNS[2B]), SD_D3 (in, see CONNS[2B]), UART_RX (out, see UI_MAIN[3B]), UART_TX (in, see UI_MAIN[3B]), USB2_N (bidir, see CONNS[2D]), USB2_P (bidir, see CONNS[2D]), X+ (in, see CONNS[3A]), X- (in, see CONNS[3A]), Y+ (in, see CONNS[3A]), Y- (in, see CONNS[3A])

### Nets
1.1V: C68.2 C69.2 C70.2 C83.2 U11.22(VDD_CORE) U11.35(VDD_CORE) U11.71(VDD_CORE)
2.5V: C66.2 C67.2 C79.2 R60.2 U11.30(VCC_DRAM) U11.31(VCC_DRAM) U11.32(VCC_DRAM) U11.34(VCC_DRAM) U11.36(VCC_DRAM)
3V: U11.80(AVCC)
3V3: C72.2 C73.2 C74.2 C75.2 C76.2 C82.2 C85.2 R54.2 R59.2 R65.2 R70.2 U10.3(/WP(IO2)) U10.7(/HOLD/RESET(IO3)) U10.8(VCC) U11.4(HPVCC) U11.5(VCCIO) U11.20(VCCIO) U11.50(VCCIO) U11.67(UVCC) U11.74(TV_VCC)
GND: C62.1 C63.1 C64.1 C65.1 C66.1 C67.1 C68.1 C69.1 C70.1 C71.1 C72.1 C73.1 C74.1 C75.1 C76.1 C77.1 C78.1 C80.1 C81.1 C82.1 C83.1 C84.1 C85.1 Q7.2(E) R56.1 R57.1 R63.1 R69.2 SW4.1 SW5.1 SW10.1 U10.4(GND) U11.73(TVGND) U11.82(AGND) U11.89(PAD) X2.2 X2.4
B0: U11.49(LCD_D0/PE0) ; port B0
B1: U11.48(LCD_D1/PE1) ; port B1
B2: U11.25(LCD_D23/PD17) ; port B2
B3: U11.24(LCD_D22/PD16) ; port B3
B4: U11.23(LCD_D21/PD15) ; port B4
B5: U11.21(LCD_D20/PD14) ; port B5
B6: U11.19(LCD_D19/PD13) ; port B6
B7: U11.18(LCD_D18/PD12) ; port B7
F1C_OSC_IN: C71.2 R58.2 U11.51(HOSCI) X2.1
F1C_OSC_OUT: C77.2 R58.1 U11.52(HOSCO) X2.3
F1C_RST: C78.2 R59.1 SW5.2 TP24.1 U11.70(RESET)
G0: U11.47(LCD_D8/PE2) ; port G0
G1: U11.46(LCD_D9/PE3) ; port G1
G2: U11.17(LCD_D15/PD11) ; port G2
G3: U11.16(LCD_D14/PD10) ; port G3
G4: U11.15(LCD_D13/PD9) ; port G4
G5: U11.14(LCD_D12/PD8) ; port G5
G6: U11.13(LCD_D11/PD7) ; port G6
G7: U11.12(LCD_D10/PD6) ; port G7
LEN: U11.27(LCD_DE/PD19) ; port LCDEN
LHSYNC: U11.28(LCD_HSYNC/PD20) ; port LCDHSYNC
LSCK: U11.26(LCD_CLK/PD18) ; port LCDCLK
LVSYNC: U11.29(LCD_VSYNC/PD21) ; port LCDVSYNC
PWM: U11.43(PWM/PE6) ; port LCD_PWM
R0: U11.45(LCD_D16/PE4) ; port R0
R1: U11.44(LCD_D17/PE5) ; port R1
R2: U11.11(LCD_D7/PD5) ; port R2
R3: U11.10(LCD_D6/PD4) ; port R3
R4: U11.9(LCD_D5/PD3) ; port R4
R5: U11.8(LCD_D4/PD2) ; port R5
R6: U11.7(LCD_D3/PD1) ; port R6
R7: U11.6(LCD_D2/PD0) ; port R7
RX: TP22.1 U11.42(UART2_TX/PE7) ; port UART_RX
SD_CK: U11.55(SDC0_CMD/PF3) ; port SD_CMD
SD_CMD: U11.56(SDC0_CLK/PF2) ; port SD_CK
SD_D0: U11.57(SDC0_D0/PF1) ; port SD_D0
SD_D1: U11.58(SDC0_D1/PF0) ; port SD_D1
SD_D2: U11.53(SDC0_D2/PF5) ; port SD_D2
SD_D3: U11.54(SDC0_D3/PF4) ; port SD_D3
SPI_MISO: U10.2(DO(IO1)) U11.61(SPI0_MISO/PC2)
SPI_MOSI: U10.5(DI(IO0)) U11.62(SPI0_MOSI/PC3)
SPI_NSS: R54.1 U10.1(/CS) U11.60(SPI0_NSS/PC1)
SPI_SCK: Q7.3(C) U10.6(CLK) U11.59(SPI0_SCK/PC0)
SVREF: C79.1 C80.2 R60.1 R63.2 U11.33(SVREF)
TX: TP23.1 U11.41(UART2_RX/PE8) ; port UART_TX
USB2_N: U11.68(USB_DM) ; port USB2_N
USB2_P: U11.69(USB_DP) ; port USB2_P
X+: U11.63(TPX1) ; port X+
X-: U11.64(TPX2) ; port X-
Y+: U11.65(TPY1) ; port Y+
Y-: U11.66(TPY2) ; port Y-
NetC62_2: C62.2 C63.2 R55.1 U11.2(HPCOMFB) ; port AUDIO_G
NetC64_2: C64.2 R56.2 U11.81(VRA1)
NetC65_2: C65.2 R57.2 U11.83(VRA2)
NetC81_2: C81.2 R65.1 SW6.2 SW7.2 SW8.2 SW9.2 SW10.2 TP21.1 U11.79(LRDAC0/BTN_ARR_IN)
NetC84_2: C84.2 Q7.1(B) R70.1 SW4.2 TP20.1
NetP7_1: U11.88(HPR) ; port AUDIO_R
NetP7_3: U11.1(HPL) ; port AUDIO_L
NetR55_2: R55.2 U11.3(HPCOM(1.65V))
NetR66_1: R66.1 SW6.1
NetR66_2: R66.2 R67.1 SW7.1
NetR67_2: R67.2 R68.1 SW8.1
NetR68_2: R68.2 R69.1 SW9.1

Not connected (* = marked no-connect by the designer): U11 37(TWI0_SDA/PE12)* 38(TWI0_SCK/PE11)* 39(UART2_CTS/PE10)* 40(UART2_RTS/PE9)* 72(TVOUT)* 75(TV_VRN)* 76(TV_VRP)* 77(TVIN1)* 78(TVIN0)* 84(FMINL)* 85(FMINR)* 86(LINL)* 87(MICIN)*

### Notes on the sheet
- VDD_CORE
- VCC_DRAM
- VCCIO
- TV_VCC
- SVREF
- F1C_1.0
- out of

### Library data of the parts
C62-C85 = CAP_0603: as C31 on sheet LCD_PWR; Supplier 1: Thegioiic; Datasheet: https://www.mouser.de/datasheet/2/447/PYu_RC_Group_51_RoHS_L_11-1984063.pdf; Supplier Link: N/a
  C62 C66 C68 C72 C74: Value: 10uF, 50V
  C63 C67 C69 C70 C73 C75 C76 C78 C82-C85: Value: 0.1uF, 50V
  C64 C65 C79-C81: Value: 0,1uF, 50V
  C71 C77: Value: 8pF, 50V
Q7 = 2SC1815: HF Transistor NPN; Manufacturer 1: TOSHIBA; Manufacturer Part Number 1: 2SC1815; Supplier 1: Thegioiic; Datasheet: https://media.digikey.com/pdf/Data%20Sheets/Toshiba%20PDFs/2SC1815.pdf; Supplier Link: https://www.thegioiic.com/2sc1815-hf-transistor-npn-50v-0-15a-3-chan-sot-23
R54-R60 R63 R65-R70 = RES_0603: as R26 on sheet LCD_PWR; Supplier 1: Thegioiic; Datasheet: https://www.mouser.de/datasheet/2/447/PYu_RC_Group_51_RoHS_L_11-1984063.pdf; Supplier Link: N/a
  R54 R59 R65-R69: Value: 10 KOhm, 1/16W
  R55: Value: 0 Ohm
  R56 R57: Value: 200 KOhm, 1/16W
  R58: Value: 1 MOhm, 1/16W
  R60 R63: Value: 2 KOhm, 1/16W
  R70: Value: 1KOhm, 1/16W
SW4-SW10 = SWSMD_NOGND: as SW1 on sheet UI_MAIN; Supplier 1: Thegioiic; Datasheet: N/a; Supplier Link: https://www.thegioiic.com/nut-nhan-3x6mm-cao-3-5mm-4-chan-smd-chinh-ngang
TP20-TP24 = TESTPT: Test point
U10 = W25Q128JVSIQ: FLASH - NOR Memory IC 128Mb (16M x 8) SPI - Quad I/O, QPI, DTR 133 MHz 8-SOIC; Manufacturer 1: Winbond; Manufacturer Part Number 1: W25Q128JVSIQ; Supplier 1: icdayroi; Datasheet: https://www.mouser.com/datasheet/2/949/w25q128jv_revf_03272018_plus-1489608.pdf?srsltid=AfmBOoo6A117SgcugjxLlAhFi3KnV-0yeS-felQazvL9ciV6qbD4kAKu; Supplier Link: https://icdayroi.com/w25q128jvssiq
U11 = F1C100s: An integrated, low-power ARM9 SoC (System-on-Chip) with 32MB of built-in DDR RAM, widely used for embedded Linux projects, media playback, and retro-gaming consoles.; Manufacturer 1: Allwinner Technology; Manufacturer Part Number 1: F1C100s; Supplier 1: Shoppee; Datasheet: https://linux-sunxi.org/images/1/11/Allwinner_F1C200s_Datasheet_V1.0.pdf; Supplier Link: https://shopee.vn/(1-C%C3%A1i)-chip-%C4%91i%E1%BB%81u-khi%E1%BB%83n-ch%C3%ADnh-ki%E1%BA%BFn-tr%C3%BAc-F1C100-F1C100S-F1C200S-QFN88-QFP128-ARM9-C%C3%B2n-h%C3%A0ng-i.1156302552.41058041933
X2 = XTAL: Crystal, 24 MHz, -30 to 85 degC, 3.2 x 2.5 x 0.9 mm SMD; Manufacturer 1: EPSON; Manufacturer Part Number 1: TSX-3225 25.0000MF20P-C0; Supplier 1: Thegioiic; Datasheet: https://www.epsondevice.com/crystal/en/; Supplier Link: https://www.thegioiic.com/thach-anh-24mhz-3225-4-chan-smd

## Sheet LCD.SchDoc: UI BOARD
size A4; SheetNumber: 8; SheetTotal: 9
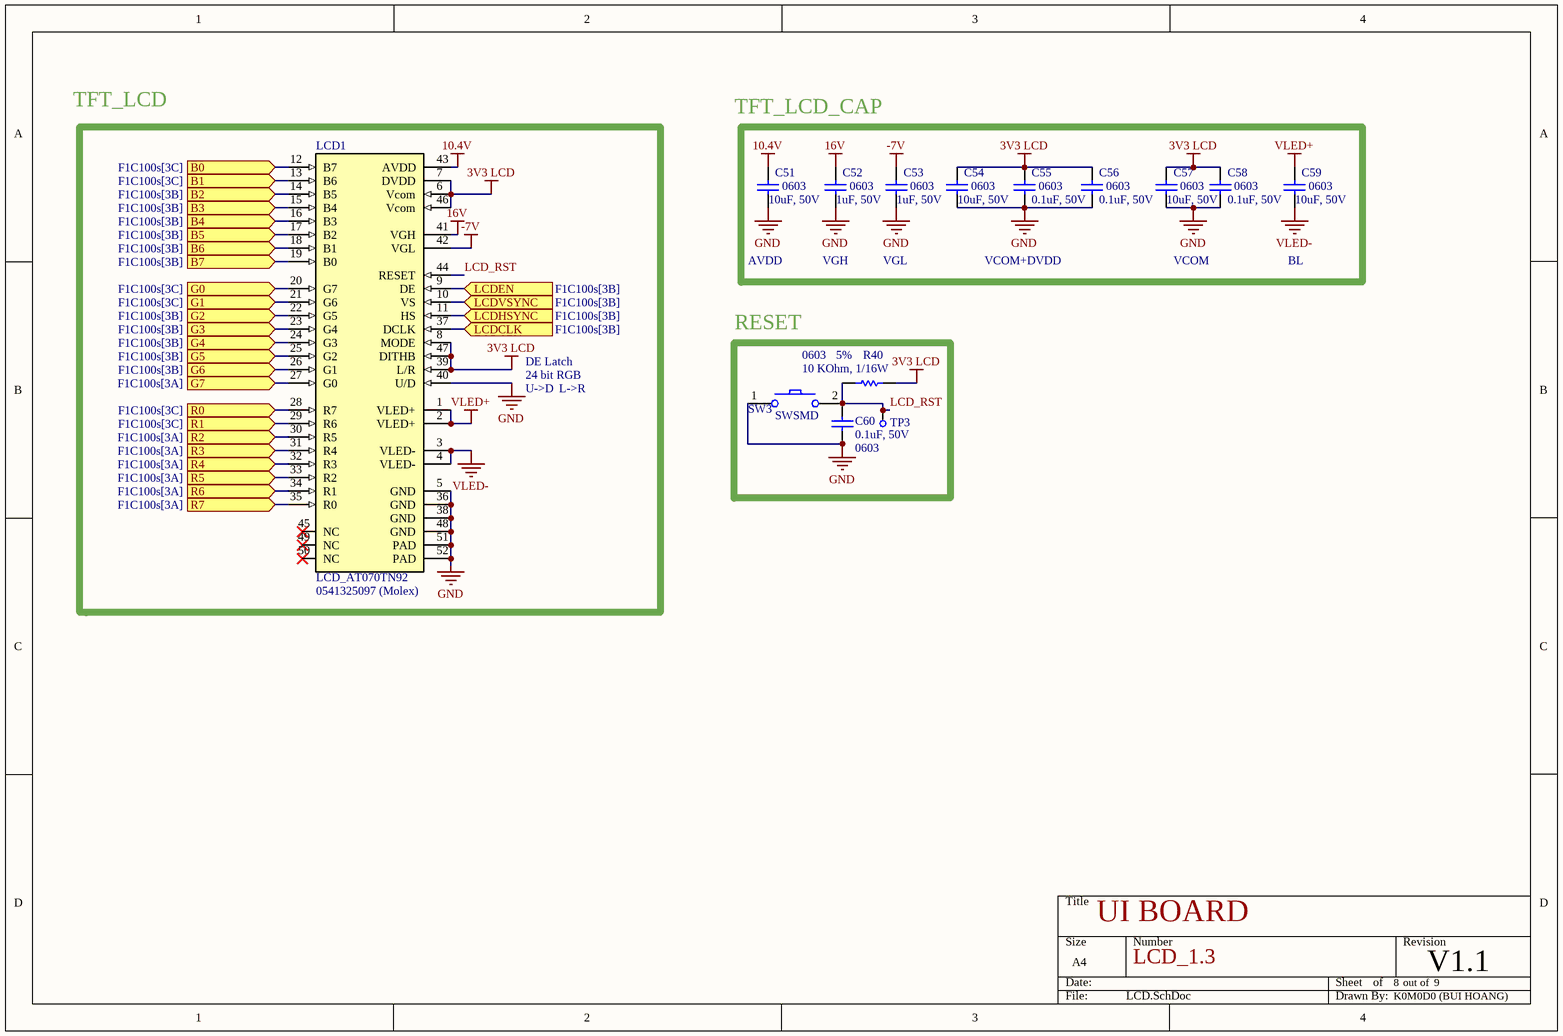
[diagram p4: LCD.SchDoc]

### Parts
C51  Package: 0603  [C_0603]  (hidden comment: 10uF, 50V)
C52  Package: 0603  [C_0603]  (hidden comment: 1uF, 50V)
C53  Package: 0603  [C_0603]  (hidden comment: 1uF, 50V)
C54  Package: 0603  [C_0603]  (hidden comment: 10uF, 50V)
C55  Package: 0603  [C_0603]  (hidden comment: 0.1uF, 50V)
C56  Package: 0603  [C_0603]  (hidden comment: 0.1uF, 50V)
C57  Package: 0603  [C_0603]  (hidden comment: 10uF, 50V)
C58  Package: 0603  [C_0603]  (hidden comment: 0.1uF, 50V)
C59  Package: 0603  [C_0603]  (hidden comment: 10uF, 50V)
C60  Package: 0603  [C_0603]  (hidden comment: 0.1uF, 50V)
LCD1  LCD_AT070TN92  Connector Part Number: 0541325097 (Molex)  [CONN_LCD_AT070TN90]
R40  Package: 0603  Acc: 5%  [R_0603]  (hidden comment: 10 KOhm, 1/16W)
SW3  SWSMD  [SW_SMD_NOGND]
TP3  TESTPT  [TESTPT]  (value not drawn)  (no BOM)

### Blocks framed on the sheet
RESET: C60 R40 SW3 TP3

### Ports
B0 (in, see F1C100s[3C]), B1 (in, see F1C100s[3C]), B2 (in, see F1C100s[3B]), B3 (in, see F1C100s[3B]), B4 (in, see F1C100s[3B]), B5 (in, see F1C100s[3B]), B6 (in, see F1C100s[3B]), B7 (in, see F1C100s[3B]), G0 (in, see F1C100s[3C]), G1 (in, see F1C100s[3C]), G2 (in, see F1C100s[3B]), G3 (in, see F1C100s[3B]), G4 (in, see F1C100s[3B]), G5 (in, see F1C100s[3B]), G6 (in, see F1C100s[3B]), G7 (in, see F1C100s[3A]), LCDCLK (in, see F1C100s[3B]), LCDEN (in, see F1C100s[3B]), LCDHSYNC (in, see F1C100s[3B]), LCDVSYNC (in, see F1C100s[3B]), R0 (in, see F1C100s[3C]), R1 (in, see F1C100s[3C]), R2 (in, see F1C100s[3A]), R3 (in, see F1C100s[3A]), R4 (in, see F1C100s[3A]), R5 (in, see F1C100s[3A]), R6 (in, see F1C100s[3A]), R7 (in, see F1C100s[3A])

### Nets
3V3 LCD: C54.2 C55.2 C56.2 C57.2 C58.2 LCD1.6(Vcom) LCD1.7(DVDD) LCD1.8(MODE) LCD1.39(L/R) LCD1.46(Vcom) LCD1.47(DITHB) R40.2
10.4V: C51.2 LCD1.43(AVDD)
16V: C52.2 LCD1.41(VGH)
-7V: C53.2 LCD1.42(VGL)
GND: C51.1 C52.1 C53.1 C54.1 C55.1 C56.1 C57.1 C58.1 C60.1 LCD1.5(GND) LCD1.36(GND) LCD1.38(GND) LCD1.40(U/D) LCD1.48(GND) LCD1.51(PAD) LCD1.52(PAD) SW3.1
VLED+: C59.2 LCD1.1(VLED+) LCD1.2(VLED+)
VLED-: C59.1 LCD1.3(VLED-) LCD1.4(VLED-)
B0: LCD1.12(B7) ; port B0
B1: LCD1.13(B6) ; port B1
B2: LCD1.14(B5) ; port B2
B3: LCD1.15(B4) ; port B3
B4: LCD1.16(B3) ; port B4
B5: LCD1.17(B2) ; port B5
B6: LCD1.18(B1) ; port B6
B7: LCD1.19(B0) ; port B7
G0: LCD1.20(G7) ; port G0
G1: LCD1.21(G6) ; port G1
G2: LCD1.22(G5) ; port G2
G3: LCD1.23(G4) ; port G3
G4: LCD1.24(G3) ; port G4
G5: LCD1.25(G2) ; port G5
G6: LCD1.26(G1) ; port G6
G7: LCD1.27(G0) ; port G7
LCD_RST: C60.2 LCD1.44(RESET) R40.1 SW3.2 TP3.1
LEN: LCD1.9(DE) ; port LCDEN
LHSYNC: LCD1.11(HS) ; port LCDHSYNC
LSCK: LCD1.37(DCLK) ; port LCDCLK
LVSYNC: LCD1.10(VS) ; port LCDVSYNC
R0: LCD1.28(R7) ; port R0
R1: LCD1.29(R6) ; port R1
R2: LCD1.30(R5) ; port R2
R3: LCD1.31(R4) ; port R3
R4: LCD1.32(R3) ; port R4
R5: LCD1.33(R2) ; port R5
R6: LCD1.34(R1) ; port R6
R7: LCD1.35(R0) ; port R7

Not connected (* = marked no-connect by the designer): LCD1 45(NC)* 49(NC)* 50(NC)*

### Notes on the sheet
- TFT_LCD
- TFT_LCD_CAP
- AVDD
- VGH
- VGL
- VCOM+DVDD
- VCOM
- BL
- DE Latch
- 24 bit RGB
- U->D
- L->R
- LCD_1.3
- out of

### Library data of the parts
C51-C60 = CAP_0603: as C31 on sheet LCD_PWR; Supplier 1: Thegioiic; Datasheet: https://www.mouser.de/datasheet/2/447/PYu_RC_Group_51_RoHS_L_11-1984063.pdf; Supplier Link: N/a
  C51 C54 C57 C59: Value: 10uF, 50V
  C52 C53: Value: 1uF, 50V
  C55 C56 C58 C60: Value: 0.1uF, 50V
LCD1 = LCD_AT070TN92: LCD 7 inch (800 x 3(RGB) x 480) RES / __NOTE THAT THIS IS FFC 50PINS CONN w/ THE LCD FOOTPRINT!__; Manufacturer 1: INNOLUXDISPLAY Corp.; Manufacturer Part Number 1: AT070TN92; Supplier 1: Thegioiic (Out of stock); Datasheet: https://mm.digikey.com/Volume0/opasdata/d220001/medias/docus/530/AT070TN92_Jan12_2009_spec.pdf; Supplier Link: https://www.thegioiic.com/lcd-7inch-rbg-800x480-at070tn92-tft-rgb-innolux
R40 = RES_0603: as R26 on sheet LCD_PWR; Supplier 1: Thegioiic; Datasheet: https://www.mouser.de/datasheet/2/447/PYu_RC_Group_51_RoHS_L_11-1984063.pdf; Supplier Link: N/a; Value: 10 KOhm, 1/16W
SW3 = SWSMD_NOGND: as SW1 on sheet UI_MAIN; Supplier 1: Thegioiic; Datasheet: N/a; Supplier Link: https://www.thegioiic.com/nut-nhan-3x6mm-cao-3-5mm-4-chan-smd-chinh-ngang
TP3 = TESTPT: Test point

## Sheet CONNS.SchDoc: UI BOARD
size A4; SheetNumber: 9; SheetTotal: 9
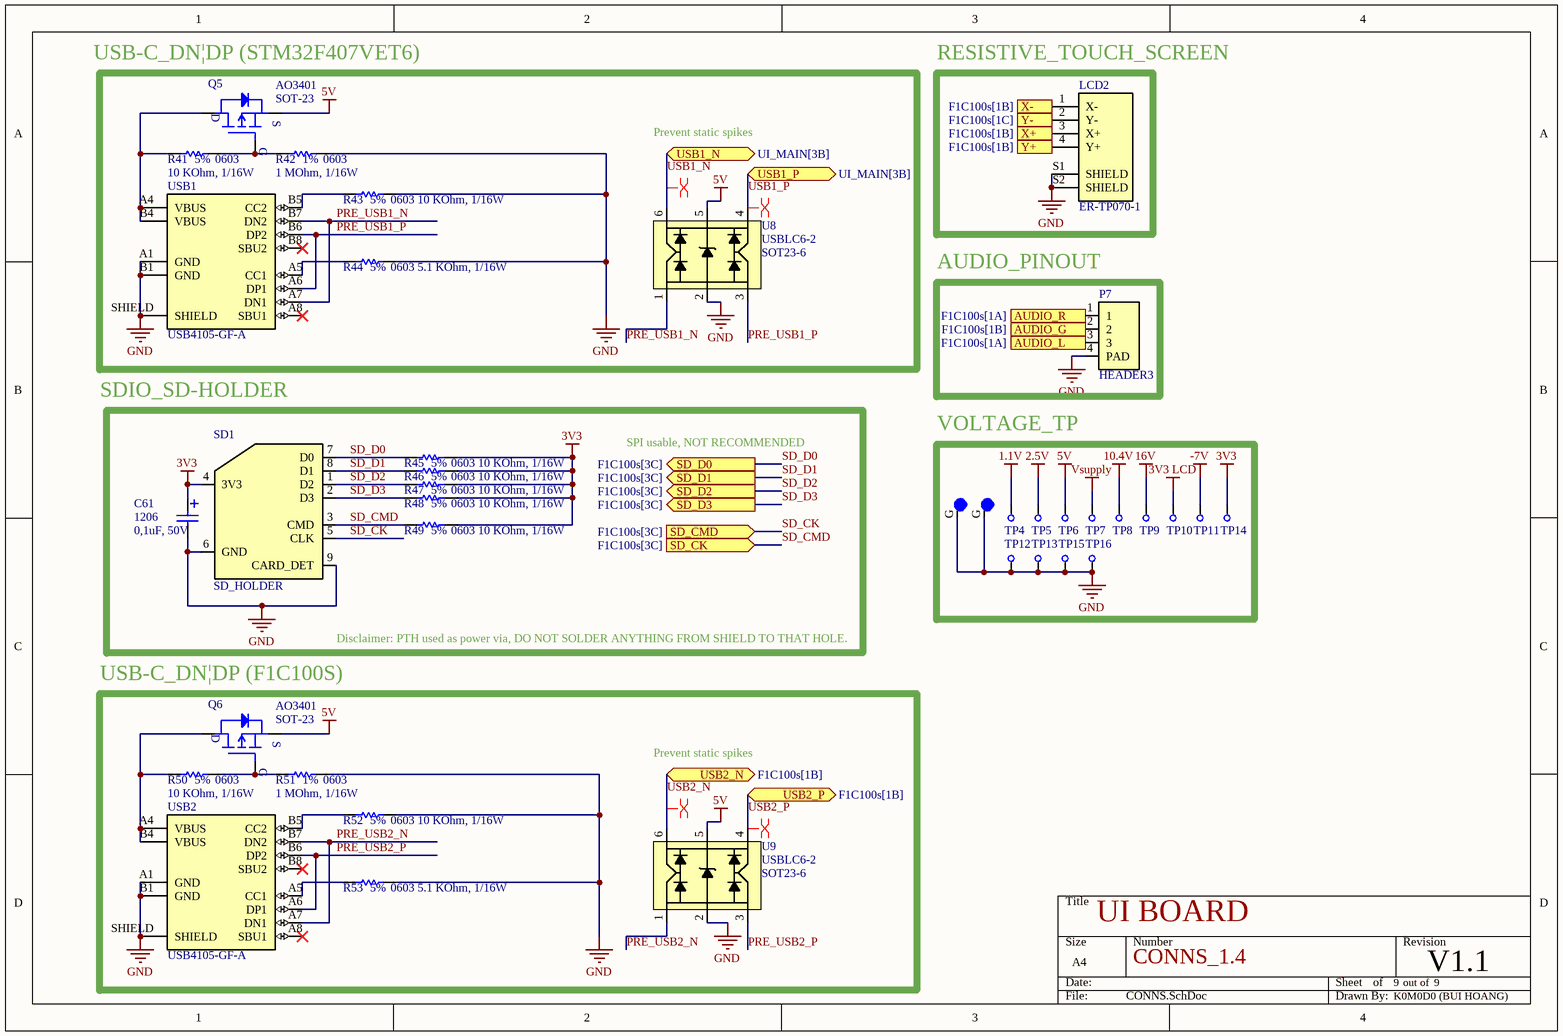
[diagram p5: CONNS.SchDoc]

### Parts
C61  Package: 1206  [C_1206+]  (hidden comment: 0,1uF, 50V)
LCD2  ER-TP070-1  [ER-TP070-1]
M1  MOUNTING_HOLE  [HOLES]  (value not drawn)  (no BOM)
M2  MOUNTING_HOLE  [HOLES]  (value not drawn)  (no BOM)
P7  HEADER3  [CONN_Header3]
Q5  AO3401  Package: SOT-23  [PKG_SOT-23]
Q6  AO3401  Package: SOT-23  [PKG_SOT-23]
R41  Package: 0603  Acc: 5%  [R_0603]  (hidden comment: 10 KOhm, 1/16W)
R42  Package: 0603  Acc: 1%  [R_0603]  (hidden comment: 1 MOhm, 1/16W)
R43  Package: 0603  Acc: 5%  [R_0603]  (hidden comment: 10 KOhm, 1/16W)
R44  Package: 0603  Acc: 5%  [R_0603]  (hidden comment: 5.1 KOhm, 1/16W)
R45  Package: 0603  Acc: 5%  [R_0603]  (hidden comment: 10 KOhm, 1/16W)
R46  Package: 0603  Acc: 5%  [R_0603]  (hidden comment: 10 KOhm, 1/16W)
R47  Package: 0603  Acc: 5%  [R_0603]  (hidden comment: 10 KOhm, 1/16W)
R48  Package: 0603  Acc: 5%  [R_0603]  (hidden comment: 10 KOhm, 1/16W)
R49  Package: 0603  Acc: 5%  [R_0603]  (hidden comment: 10 KOhm, 1/16W)
R50  Package: 0603  Acc: 5%  [R_0603]  (hidden comment: 10 KOhm, 1/16W)
R51  Package: 0603  Acc: 1%  [R_0603]  (hidden comment: 1 MOhm, 1/16W)
R52  Package: 0603  Acc: 5%  [R_0603]  (hidden comment: 10 KOhm, 1/16W)
R53  Package: 0603  Acc: 5%  [R_0603]  (hidden comment: 5.1 KOhm, 1/16W)
SD1  SD_HOLDER  [CONN_SD_Holder]
TP4  TESTPT  [TESTPT]  (value not drawn)  (no BOM)
TP5  TESTPT  [TESTPT]  (value not drawn)  (no BOM)
TP6  TESTPT  [TESTPT]  (value not drawn)  (no BOM)
TP7  TESTPT  [TESTPT]  (value not drawn)  (no BOM)
TP8  TESTPT  [TESTPT]  (value not drawn)  (no BOM)
TP9  TESTPT  [TESTPT]  (value not drawn)  (no BOM)
TP10  TESTPT  [TESTPT]  (value not drawn)  (no BOM)
TP11  TESTPT  [TESTPT]  (value not drawn)  (no BOM)
TP12  TESTPT  [TESTPT]  (value not drawn)  (no BOM)
TP13  TESTPT  [TESTPT]  (value not drawn)  (no BOM)
TP14  TESTPT  [TESTPT]  (value not drawn)  (no BOM)
TP15  TESTPT  [TESTPT]  (value not drawn)  (no BOM)
TP16  TESTPT  [TESTPT]  (value not drawn)  (no BOM)
U8  USBLC6-2  Pkg: SOT23-6  [PKG-SOT23-6]
U9  USBLC6-2  Pkg: SOT23-6  [PKG-SOT23-6]
USB1  USB4105-GF-A  [CONN_USB-C]
USB2  USB4105-GF-A  [CONN_USB-C]

### Blocks framed on the sheet
Prevent static spikes: Q5 R41-R44 U8 USB1
RESISTIVE_TOUCH_SCREEN: LCD2
AUDIO_PINOUT: P7
SPI usable, NOT RECOMMENDED: C61 R45-R49 SD1
VOLTAGE_TP: M1 M2 TP4-TP16
USB-C_DN|DP (F1C100S): Q6 R50-R53 U9 USB2

### Ports
AUDIO_G (in, see F1C100s[1B]), AUDIO_L (in, see F1C100s[1A]), AUDIO_R (in, see F1C100s[1A]), SD_CK (in, see F1C100s[3C]), SD_CMD (in, see F1C100s[3C]), SD_D0 (out, see F1C100s[3C]), SD_D1 (out, see F1C100s[3C]), SD_D2 (out, see F1C100s[3C]), SD_D3 (out, see F1C100s[3C]), USB1_N (bidir, see UI_MAIN[3B]), USB1_P (bidir, see UI_MAIN[3B]), USB2_N (bidir, see F1C100s[1B]), USB2_P (bidir, see F1C100s[1B]), X+ (out, see F1C100s[1B]), X- (out, see F1C100s[1B]), Y+ (out, see F1C100s[1B]), Y- (out, see F1C100s[1C])

### Nets
1.1V: TP4.1
2.5V: TP5.1
3V3: C61.2 R45.2 R46.2 R47.2 R48.2 R49.2 SD1.4(3V3) TP14.1
3V3 LCD: TP10.1
5V: Q5.2(S) Q6.2(S) TP6.1 U8.5 U9.5
10.4V: TP8.1
16V: TP9.1
-7V: TP11.1
GND: C61.1 LCD2.S1(SHIELD) LCD2.S2(SHIELD) M1.G M2.G P7.4(PAD) R42.2 R43.2 R44.2 R51.2 R52.2 R53.2 SD1.6(GND) SD1.9(CARD_DET) TP12.1 TP13.1 TP15.1 TP16.1 U8.2 U9.2 USB1.A1(GND) USB1.B1(GND) USB1.SHIELD USB2.A1(GND) USB2.B1(GND) USB2.SHIELD
Vsupply: TP7.1
PRE_USB1_N: U8.1 USB1.A7(DN1) USB1.B7(DN2)
PRE_USB1_P: U8.3 USB1.A6(DP1) USB1.B6(DP2)
PRE_USB2_N: U9.1 USB2.A7(DN1) USB2.B7(DN2)
PRE_USB2_P: U9.3 USB2.A6(DP1) USB2.B6(DP2)
SD_CK: SD1.5(CLK) ; port SD_CMD
SD_CMD: R49.1 SD1.3(CMD) ; port SD_CK
SD_D0: R45.1 SD1.7(D0) ; port SD_D0
SD_D1: R46.1 SD1.8(D1) ; port SD_D1
SD_D2: R47.1 SD1.1(D2) ; port SD_D2
SD_D3: R48.1 SD1.2(D3) ; port SD_D3
USB1_N: U8.6 ; port USB1_N
USB1_P: U8.4 ; port USB1_P
USB2_N: U9.6 ; port USB2_N
USB2_P: U9.4 ; port USB2_P
X+: LCD2.3(X+) ; port X+
X-: LCD2.1(X-) ; port X-
Y+: LCD2.4(Y+) ; port Y+
Y-: LCD2.2(Y-) ; port Y-
NetC62_2: P7.2 ; port AUDIO_G
NetP7_1: P7.1 ; port AUDIO_R
NetP7_3: P7.3 ; port AUDIO_L
NetQ5_1: Q5.1(G) R41.2 R42.1
NetQ5_3: Q5.3(D) R41.1 USB1.A4(VBUS) USB1.B4(VBUS)
NetQ6_1: Q6.1(G) R50.2 R51.1
NetQ6_3: Q6.3(D) R50.1 USB2.A4(VBUS) USB2.B4(VBUS)
NetR43_1: R43.1 USB1.B5(CC2)
NetR44_1: R44.1 USB1.A5(CC1)
NetR52_1: R52.1 USB2.B5(CC2)
NetR53_1: R53.1 USB2.A5(CC1)

Not connected (* = marked no-connect by the designer): USB1 A8(SBU1)* B8(SBU2)*; USB2 A8(SBU1)* B8(SBU2)*

### Layout directives
differential pair: USB1_N, USB1_P, USB2_N, USB2_P

### Notes on the sheet
- (near Q5) USB-C_DN|DP (STM32F407VET6)
- SDIO_SD-HOLDER
- Disclaimer: PTH used as power via, DO NOT SOLDER ANYTHING FROM SHIELD TO THAT HOLE.
- Prevent static spikes
- CONNS_1.4
- out of

### Library data of the parts
C61 = CAP+1206: Manufacturer 1: OEM; Manufacturer Part Number 1: N/a; Supplier 1: Thegioiic; Datasheet: N/a; Supplier Link: N/a; Value: 0,1uF, 50V
LCD2 = ER-TP070-1: 7 ”Resistive Touch Panel; Manufacturer 1: EastRising; Manufacturer Part Number 1: ER-TP070-1; Supplier 1: trangiahcm; Datasheet: https://www.buydisplay.com/download/manual/ER-TFT070-2_Datasheet.pdf?srsltid=AfmBOoocyeKFVUV0E77nS_42dAg9JdCzPEYk2mMDtH1qp8-WkBG6DKe6; Supplier Link: https://trangiahcm.com/tam-cam-ung-cong-nghiep-7-0-inch-cap-4-chan-164-100-mm-152-86-mm--1740627184.html
P7 = HEADER3: Header 3 pins (2.54mm; Manufacturer 1: OEM; Manufacturer Part Number 1: XH2.54mm 3; Supplier 1: Thegioiic; Datasheet: N/a; Supplier Link: https://www.thegioiic.com/dau-xh2-54mm-3-chan-dan-smd-nam-ngang
Q5 Q6 = AO3401: as Q4 on sheet LCD_PWR; Manufacturer Part Number 1: AO3401; Supplier 1: ICDayroi; Datasheet: https://www.snapeda.com/parts/AO3401/Alpha%20&%20Omega%20Semiconductor/datasheet/; Supplier Link: https://icdayroi.com/ao3401
R41-R53 = RES_0603: as R26 on sheet LCD_PWR; Supplier 1: Thegioiic; Datasheet: https://www.mouser.de/datasheet/2/447/PYu_RC_Group_51_RoHS_L_11-1984063.pdf; Supplier Link: N/a
  R41 R43 R45-R50 R52: Value: 10 KOhm, 1/16W
  R42 R51: Value: 1 MOhm, 1/16W
  R44 R53: Value: 5.1 KOhm, 1/16W
SD1 = SD_HOLDER: MICRO SD MEMORY CARD SOCKET; Manufacturer 1: OEM; Manufacturer Part Number 1: MiSD-PP-9P-V1; Supplier 1: Thegioiic; Datasheet: N/a; Supplier Link: https://www.thegioiic.com/misd-pp-9p-v1-khay-the-nho-microsd-9-chan-push-push; Package: MicroSD
TP4-TP16 = TESTPT: Test point
U8 U9 = USBLC6-2: Electrostatic Discharge Protection Device; Manufacturer 1: ST; Manufacturer Part Number 1: USBLC6-2; Supplier 1: icdayroi; Datasheet: https://www.st.com/resource/en/datasheet/usblc6-2.pdf; Supplier Link: https://icdayroi.com/usblc6-2sc6-tvs-diode-5-25v-17v-sot23-6
USB1 USB2 = USB_C: USB Type C Receptacle for USB2.0, SMT Type, PCB Top Mount; Manufacturer 1: GCT; Manufacturer Part Number 1: USB4105-GF-A; Supplier 1: Thegioiic; Datasheet: https://gct.co/files/specs/usb4105-spec.pdf; Supplier Link: https://www.thegioiic.com/cong-usb-cai-3-1-type-c-16-chan-thang-dan-smd; Supplier Link 2: https://www.digikey.com/en/products/detail/gct/USB4105-GF-A/11198510
M1 M2 = MOUNTING_HOLE: ComponentLink1Description: New link; ComponentLink1URL: *

## Nets that join several sheets
1.1V: F1C100s (7 pins), CONNS (TP4.1)
2.5V: F1C100s (9 pins), CONNS (TP5.1)
3V3: LCD_PWR (R39.1), UI_MAIN (SW2.2), F1C100s (20 pins), CONNS (8 pins)
3V3 LCD: LCD_PWR (6 pins), UI_MAIN (21 pins), LCD (12 pins), CONNS (TP10.1)
5V: LCD_PWR (R28.1), UI_MAIN (P3.18), CONNS (5 pins)
10.4V: LCD_PWR (5 pins), LCD (C51.2 LCD1.43), CONNS (TP8.1)
16V: LCD_PWR (C40.2 D6.1 R33.2), LCD (C52.2 LCD1.41), CONNS (TP9.1)
-7V: LCD_PWR (C41.1 D5.2 R34.2), LCD (C53.2 LCD1.42), CONNS (TP11.1)
GND: LCD_PWR (29 pins), UI_MAIN (33 pins), F1C100s (37 pins), LCD (17 pins), CONNS (26 pins)
Vsupply: LCD_PWR (13 pins), CONNS (TP7.1)
B0: F1C100s (U11.49), LCD (LCD1.12)
B1: F1C100s (U11.48), LCD (LCD1.13)
B2: F1C100s (U11.25), LCD (LCD1.14)
B3: F1C100s (U11.24), LCD (LCD1.15)
B4: F1C100s (U11.23), LCD (LCD1.16)
B5: F1C100s (U11.21), LCD (LCD1.17)
B6: F1C100s (U11.19), LCD (LCD1.18)
B7: F1C100s (U11.18), LCD (LCD1.19)
G0: F1C100s (U11.47), LCD (LCD1.20)
G1: F1C100s (U11.46), LCD (LCD1.21)
G2: F1C100s (U11.17), LCD (LCD1.22)
G3: F1C100s (U11.16), LCD (LCD1.23)
G4: F1C100s (U11.15), LCD (LCD1.24)
G5: F1C100s (U11.14), LCD (LCD1.25)
G6: F1C100s (U11.13), LCD (LCD1.26)
G7: F1C100s (U11.12), LCD (LCD1.27)
LEN: F1C100s (U11.27), LCD (LCD1.9)
LHSYNC: F1C100s (U11.28), LCD (LCD1.11)
LSCK: F1C100s (U11.26), LCD (LCD1.37)
LVSYNC: F1C100s (U11.29), LCD (LCD1.10)
NetC62_2: F1C100s (C62.2 C63.2 R55.1 U11.2), CONNS (P7.2)
NetP7_1: F1C100s (U11.88), CONNS (P7.1)
NetP7_3: F1C100s (U11.1), CONNS (P7.3)
R0: F1C100s (U11.45), LCD (LCD1.28)
R1: F1C100s (U11.44), LCD (LCD1.29)
R2: F1C100s (U11.11), LCD (LCD1.30)
R3: F1C100s (U11.10), LCD (LCD1.31)
R4: F1C100s (U11.9), LCD (LCD1.32)
R5: F1C100s (U11.8), LCD (LCD1.33)
R6: F1C100s (U11.7), LCD (LCD1.34)
R7: F1C100s (U11.6), LCD (LCD1.35)
RX: UI_MAIN (U5.69), F1C100s (TP22.1 U11.42)
SD_CK: F1C100s (U11.55), CONNS (SD1.5)
SD_CMD: F1C100s (U11.56), CONNS (R49.1 SD1.3)
SD_D0: F1C100s (U11.57), CONNS (R45.1 SD1.7)
SD_D1: F1C100s (U11.58), CONNS (R46.1 SD1.8)
SD_D2: F1C100s (U11.53), CONNS (R47.1 SD1.1)
SD_D3: F1C100s (U11.54), CONNS (R48.1 SD1.2)
TX: UI_MAIN (U5.68), F1C100s (TP23.1 U11.41)
USB1_N: UI_MAIN (U5.70), CONNS (U8.6)
USB1_P: UI_MAIN (U5.71), CONNS (U8.4)
USB2_N: F1C100s (U11.68), CONNS (U9.6)
USB2_P: F1C100s (U11.69), CONNS (U9.4)
X+: F1C100s (U11.63), CONNS (LCD2.3)
X-: F1C100s (U11.64), CONNS (LCD2.1)
Y+: F1C100s (U11.65), CONNS (LCD2.4)
Y-: F1C100s (U11.66), CONNS (LCD2.2)